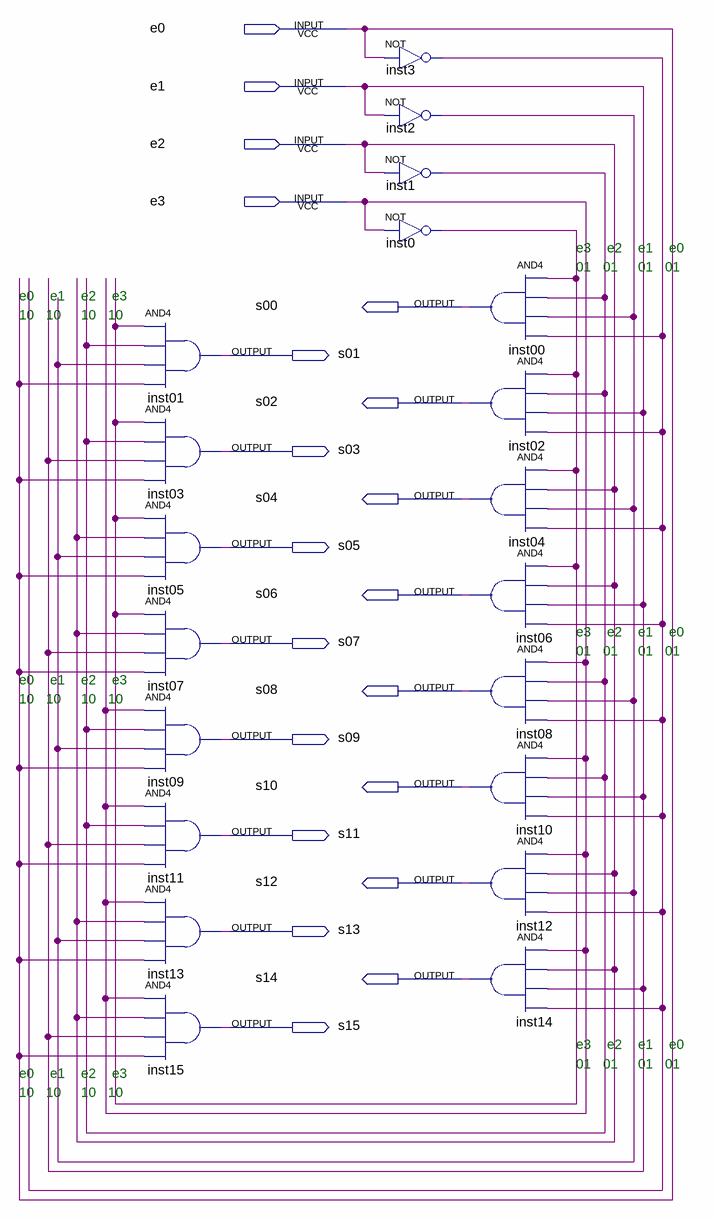
[diagram p0: schematic sheet]
// Quartus schematic Decod4x16.bdf as structural Verilog: 20 symbols, 20 pins
module Decod4x16 (
  input  e0,
  input  e1,
  input  e2,
  input  e3,
  output s00,
  output s01,
  output s02,
  output s03,
  output s04,
  output s05,
  output s06,
  output s07,
  output s08,
  output s09,
  output s10,
  output s11,
  output s12,
  output s13,
  output s14,
  output s15
);

  wire inst0_out, inst1_out, inst2_out, inst3_out;

  and inst01 (s01, inst0_out, inst1_out, inst2_out, e0);
  and inst03 (s03, inst0_out, inst1_out, e1, e0);
  and inst05 (s05, inst0_out, e2, inst2_out, e0);
  and inst07 (s07, inst0_out, e2, e1, e0);
  and inst09 (s09, e3, inst1_out, inst2_out, e0);
  and inst11 (s11, e3, inst1_out, e1, e0);
  and inst13 (s13, e3, e2, inst2_out, e0);
  and inst15 (s15, e3, e2, e1, e0);
  not inst3 (inst3_out, e0);
  not inst2 (inst2_out, e1);
  not inst1 (inst1_out, e2);
  not inst0 (inst0_out, e3);
  and inst00 (s00, inst0_out, inst1_out, inst2_out, inst3_out);
  and inst02 (s02, inst0_out, inst1_out, e1, inst3_out);
  and inst04 (s04, inst0_out, e2, inst2_out, inst3_out);
  and inst06 (s06, inst0_out, e2, e1, inst3_out);
  and inst08 (s08, e3, inst1_out, inst2_out, inst3_out);
  and inst10 (s10, e3, inst1_out, e1, inst3_out);
  and inst12 (s12, e3, e2, inst2_out, inst3_out);
  and inst14 (s14, e3, e2, e1, inst3_out);

  // Notes on the sheet:
  //   e3    e2    e1    e0
  //   01   01     01   01
  //   e0    e1    e2    e3
  //   10   10     10   10
  //   e3    e2    e1    e0
  //   01   01     01   01
  //   e0    e1    e2    e3
  //   10   10     10   10
  //   e3    e2    e1    e0
  //   01   01     01   01
  //   e0    e1    e2    e3
  //   10   10     10   10
endmodule
